# EAGLE design lcd (EAGLE 9.6.2)
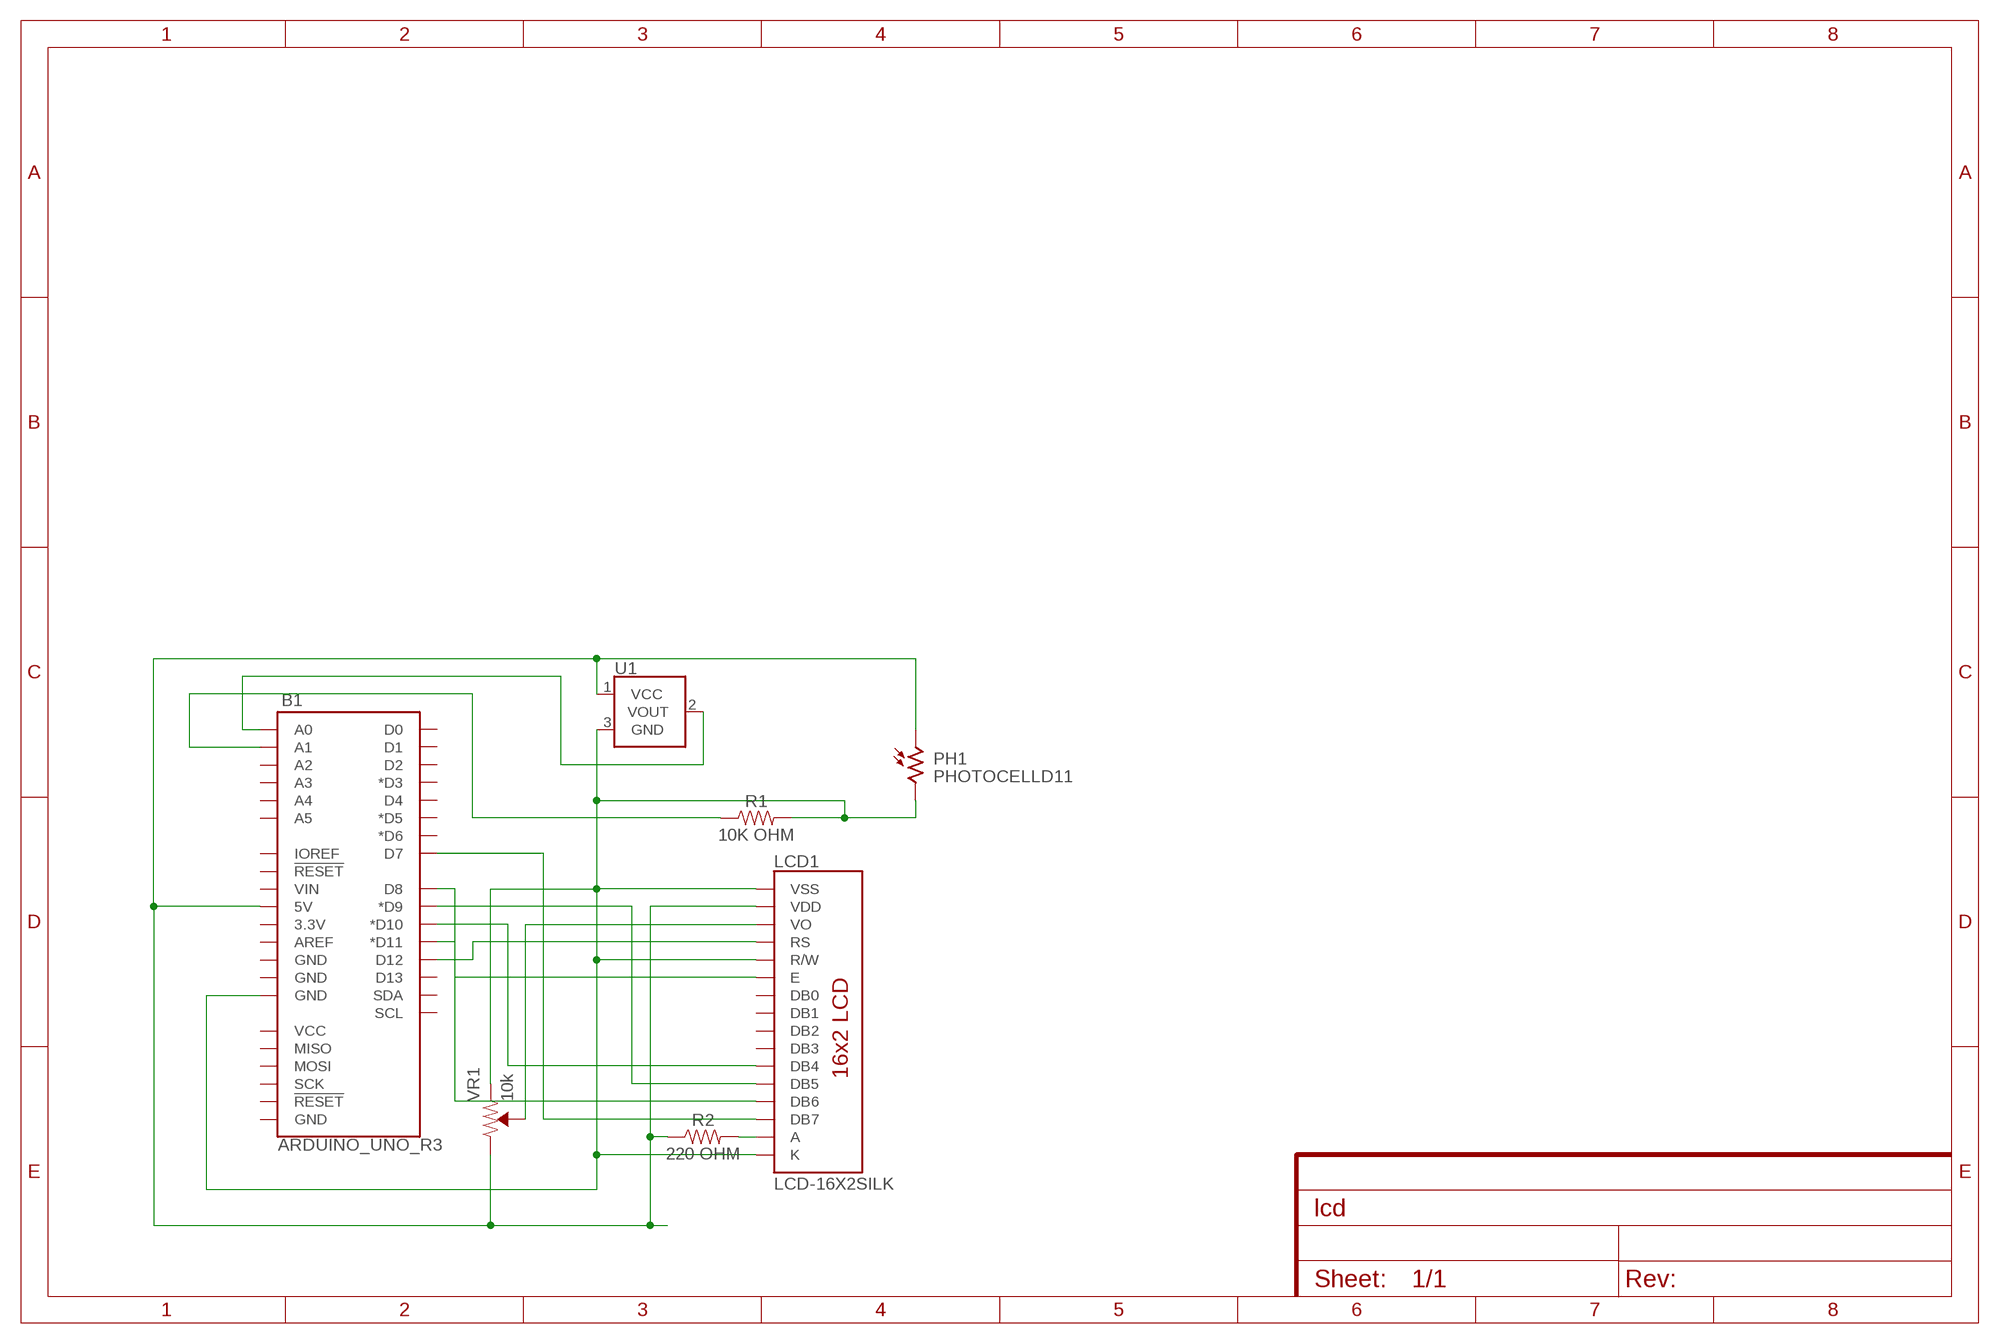
[diagram p0: schematic, sheet 1]

## Parts
B1  ARDUINO_UNO_R3  [ARDUINO_R3]
LCD1  LCD-16X2SILK  [LCD-16X2]
PH1  PHOTOCELLD11  [D11XX_H]
R1  10K OHM  RESISTORAXIAL-0.3  [AXIAL-0.3]
R2  220 OHM  RESISTORAXIAL-0.3  [AXIAL-0.3]
U1  TMP36GT9  [TO-92]
VR1  10k  TRIMPOT-PTH-10MM-KNOB-1/2W-10%  [TRIMPOT-PTH-3386U]

## Nets
N$1: B1.A1 R1.P$1
N$2: B1.A0 U1.2(VOUT)
N$3: B1.5V LCD1.2(VDD) PH1.1 R2.P$1 U1.1(VCC) VR1.3(CW)
N$4: B1.GND@2(GND) LCD1.1(VSS) LCD1.5(R/W) LCD1.16(K) PH1.2 R1.P$2 U1.3(GND) VR1.1(CCW)
N$6: LCD1.3(VO) VR1.2(WIPER)
N$7: LCD1.15(A) R2.P$2
N$8: B1.D7 LCD1.14(DB7)
N$9: B1.D12 LCD1.4(RS)
N$10: B1.D11(*D11) LCD1.6(E)
N$11: B1.D9(*D9) LCD1.12(DB5)
N$12: B1.D8 LCD1.13(DB6)
N$13: B1.D10(*D10) LCD1.11(DB4)
Unconnected: B1.3.3V B1.A2 B1.A3 B1.A4 B1.A5 B1.AREF B1.D0 B1.D1 B1.D2 B1.D3(*D3) B1.D4 B1.D5(*D5) B1.D6(*D6) B1.D13 B1.GND@1(GND) B1.GND@3(GND) B1.GND@4(GND) B1.IOREF B1.MISO B1.MOSI B1.RESET@1(!RESET!) B1.RESET@2(!RESET!) B1.SCK B1.SCL B1.SDA B1.VCC B1.VIN LCD1.7(DB0) LCD1.8(DB1) LCD1.9(DB2) LCD1.10(DB3)

## Library data of the parts
B1 = SparkFun-Boards:ARDUINO_UNO_R3: Arduino R3 Footprint with SPI header Arduino Uno R3 Compatible Footprint. Matches PCB size of the original board. SparkFun Products: SAMD21 Dev Breakout <https://www.sparkfun.com/products/13672> RedBoard <https://www.sparkfun.com/products/12757> R3 Stackable Headers <https://www.sparkfun.com/products/11417>
LCD1 = SparkFun-Displays:LCD-16X2: Standard text-only 16x2 parallel input LCD Basic 16 character by 2 line display. Typically utilizes the extremely common HD44780 parallel interface chipset SparkFun Products: Basic 16x2 Green <https://www.sparkfun.com/products/255> Basic 8x2 Green <https://www.sparkfun.com/products/11122>; PROD_ID: LCD-12633; SF_ID: LCD-00255
PH1 = photo-elements:PHOTOCELL: Photo Sensor
R1 R2 = SparkFun-Resistors:RESISTOR: Generic Resistor Package
U1 = SparkFun-Sensors:TMP36: TMP36 Precision Analog °C Temperature Sensor The TMP36 is a low voltage, precision centigrade temperature sensor. It provides a voltage output that is linearly proportional to the Celsius temperature. It also doesn’t require any external calibration to provide typical accuracies of ±1°C at +25°C and ±2°C over the −40°C to +125°C temperature range. We like it because it’s so easy to use: Just give the device a ground and 2.7 to 5.5 VDC and read the voltage on the Vout pin. The output voltage can be converted to temperature easily using the scale factor of 10 mV/°C. Datasheet <http://cdn.sparkfun.com/datasheets/Sensors/Temp/TMP35_36_37.pdf> SparkFun Products Temperature Sensor - TMP36 <https://www.sparkfun.com/products/10988> (SEN-10988) SparkFun Danger Shield <https://www.sparkfun.com/products/11649> (DEV-11649); PROD_ID: IC-09880; SF_ID: SEN-10988
VR1 = SparkFun-Resistors:TRIMPOT: Trimming Potentiometer (Trimpot) Three-terminal potentiometers, with an adjustable wiper and two adjustable resistors. A pot can be used to create a configurable voltage divider, or as a variable resistor. "Trimpots" are a subset of potentiometers, usually intended for "set-and-forget" applications. They're often more delicate than standard potentiometers - rated for fewer turns. Variants PTH-KNOB - PTH Trimpot w/ finger-adjustable knob Trimpot 10K with Knob <https://www.sparkfun.com/products/9806> (COM-09806) Datasheet <http://www.sparkfun.com/datasheets/Components/General/TSR-3386.pdf> SMD-3MM-CLOSED-FRAME - SMD 3mm Square Closed-Frame Trimpot Used on e.g. EasyDriver - Stepper Motor Driver <https://www.sparkfun.com/products/12779> Datasheet <http://www.bitechnologies.com/pdfs/22.pdf> (22AR10KTR) SMD-5MM - SMD 5mm Square Closed-Frame Trimpot Used on e.g. IOIO-OTG - V2.2 <https://www.sparkfun.com/products/13613> Datasheet <http://www.vishay.com/docs/51008/ts53.pdf> (TS53YL502MR10) SMD-3MM-1/10W-25% - 3mm Square Open-Frame Trimpot Used on e.g. SparkFun Shapeoko <https://www.sparkfun.com/products/13899> Datasheet <http://www.bourns.com/docs/Product-Datasheets/TC33.pdf> (TC33X-2-103E); PROD_ID: RES-09730; SF_SKU: COM-09806

## Board
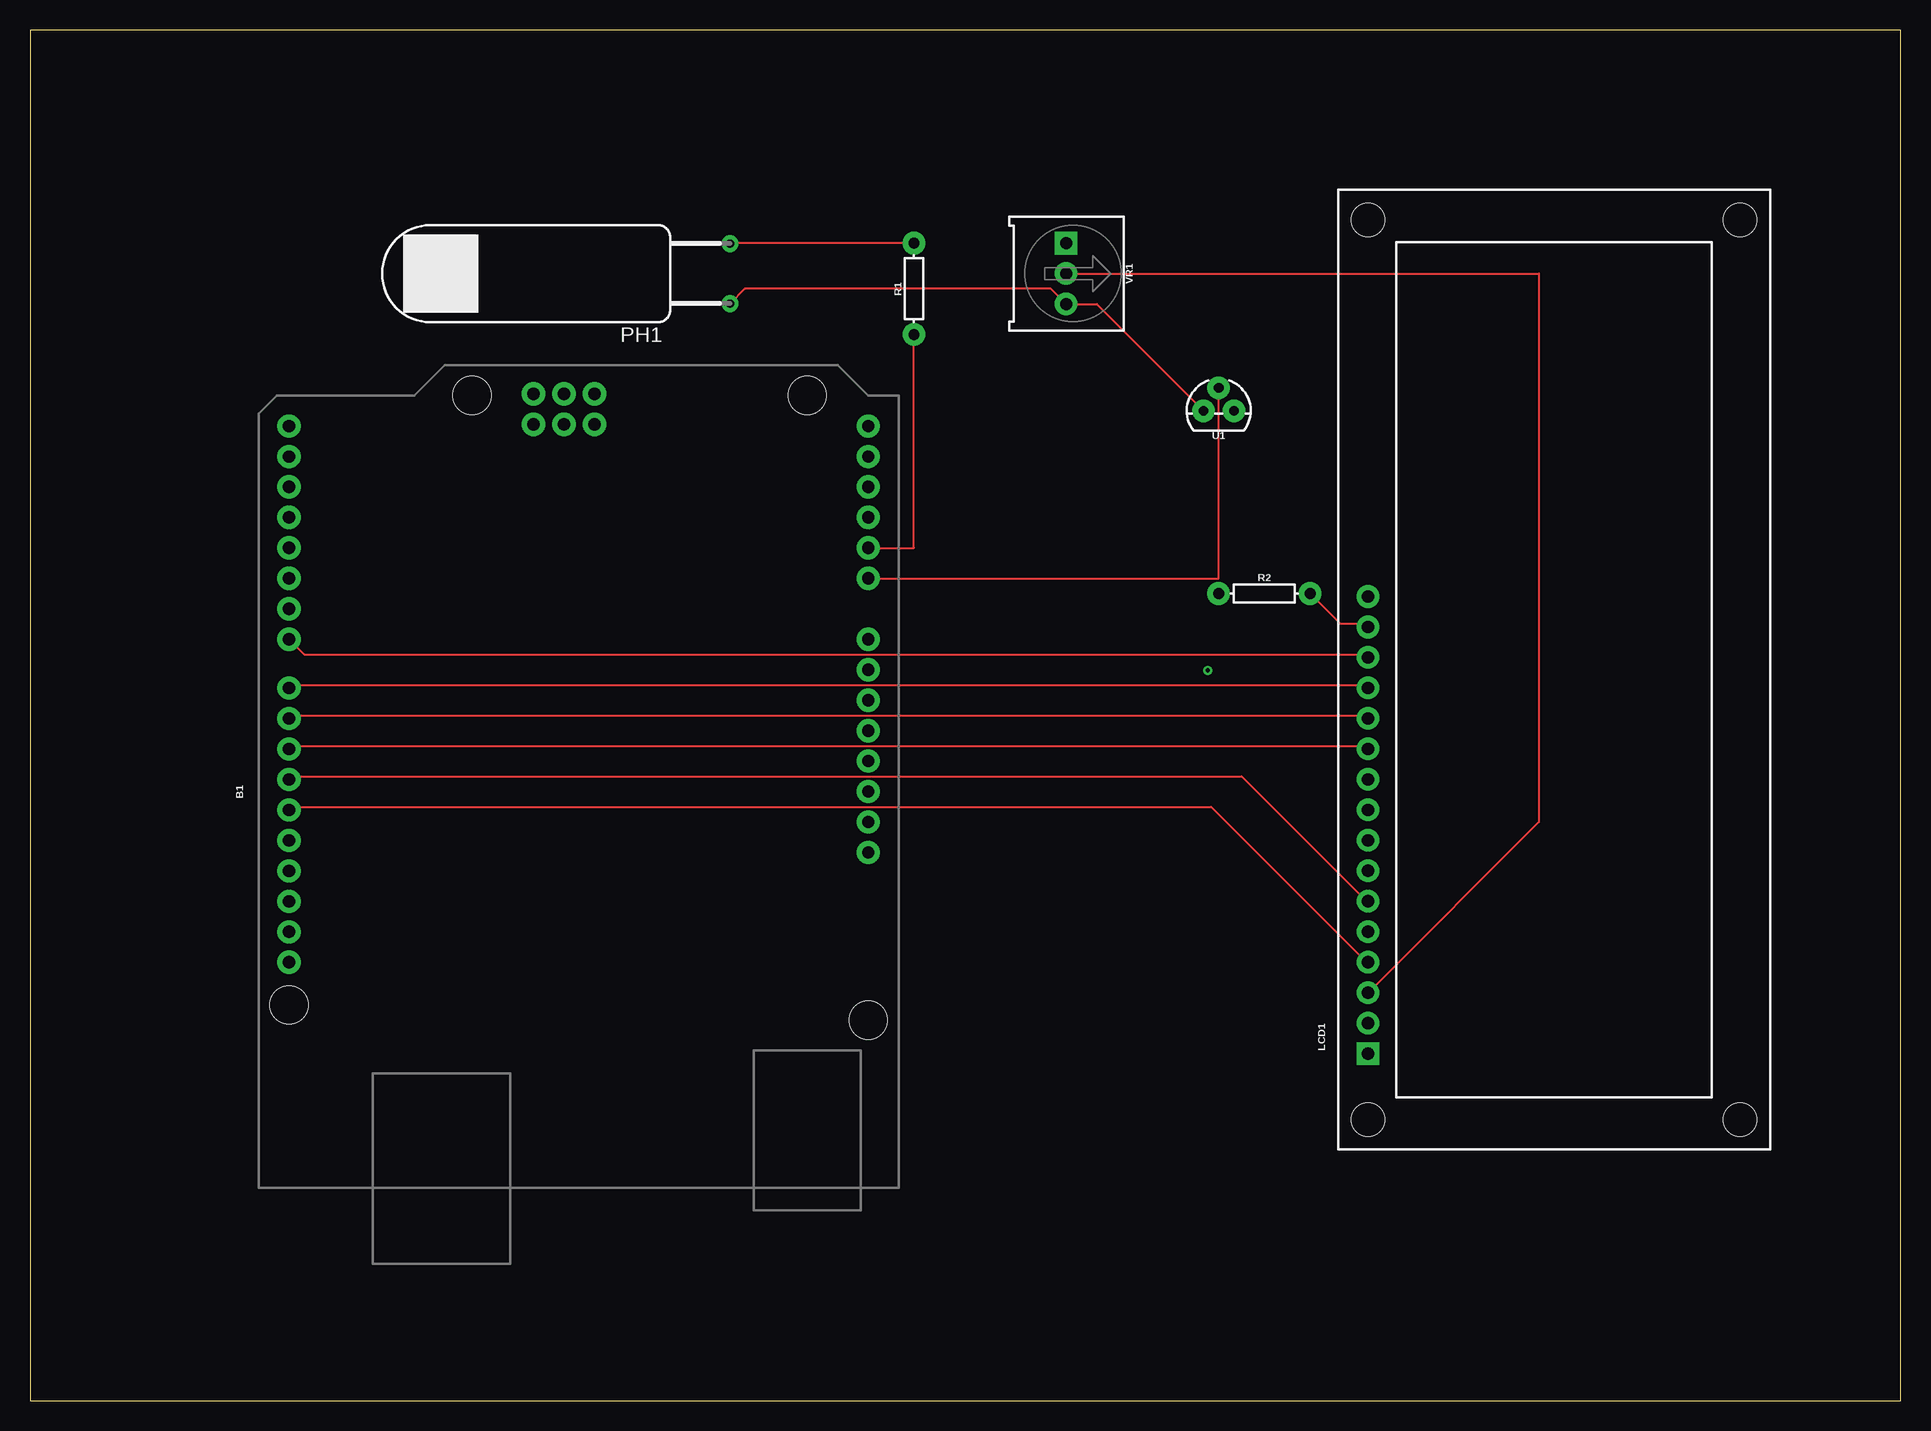
[diagram p1: board, top side]
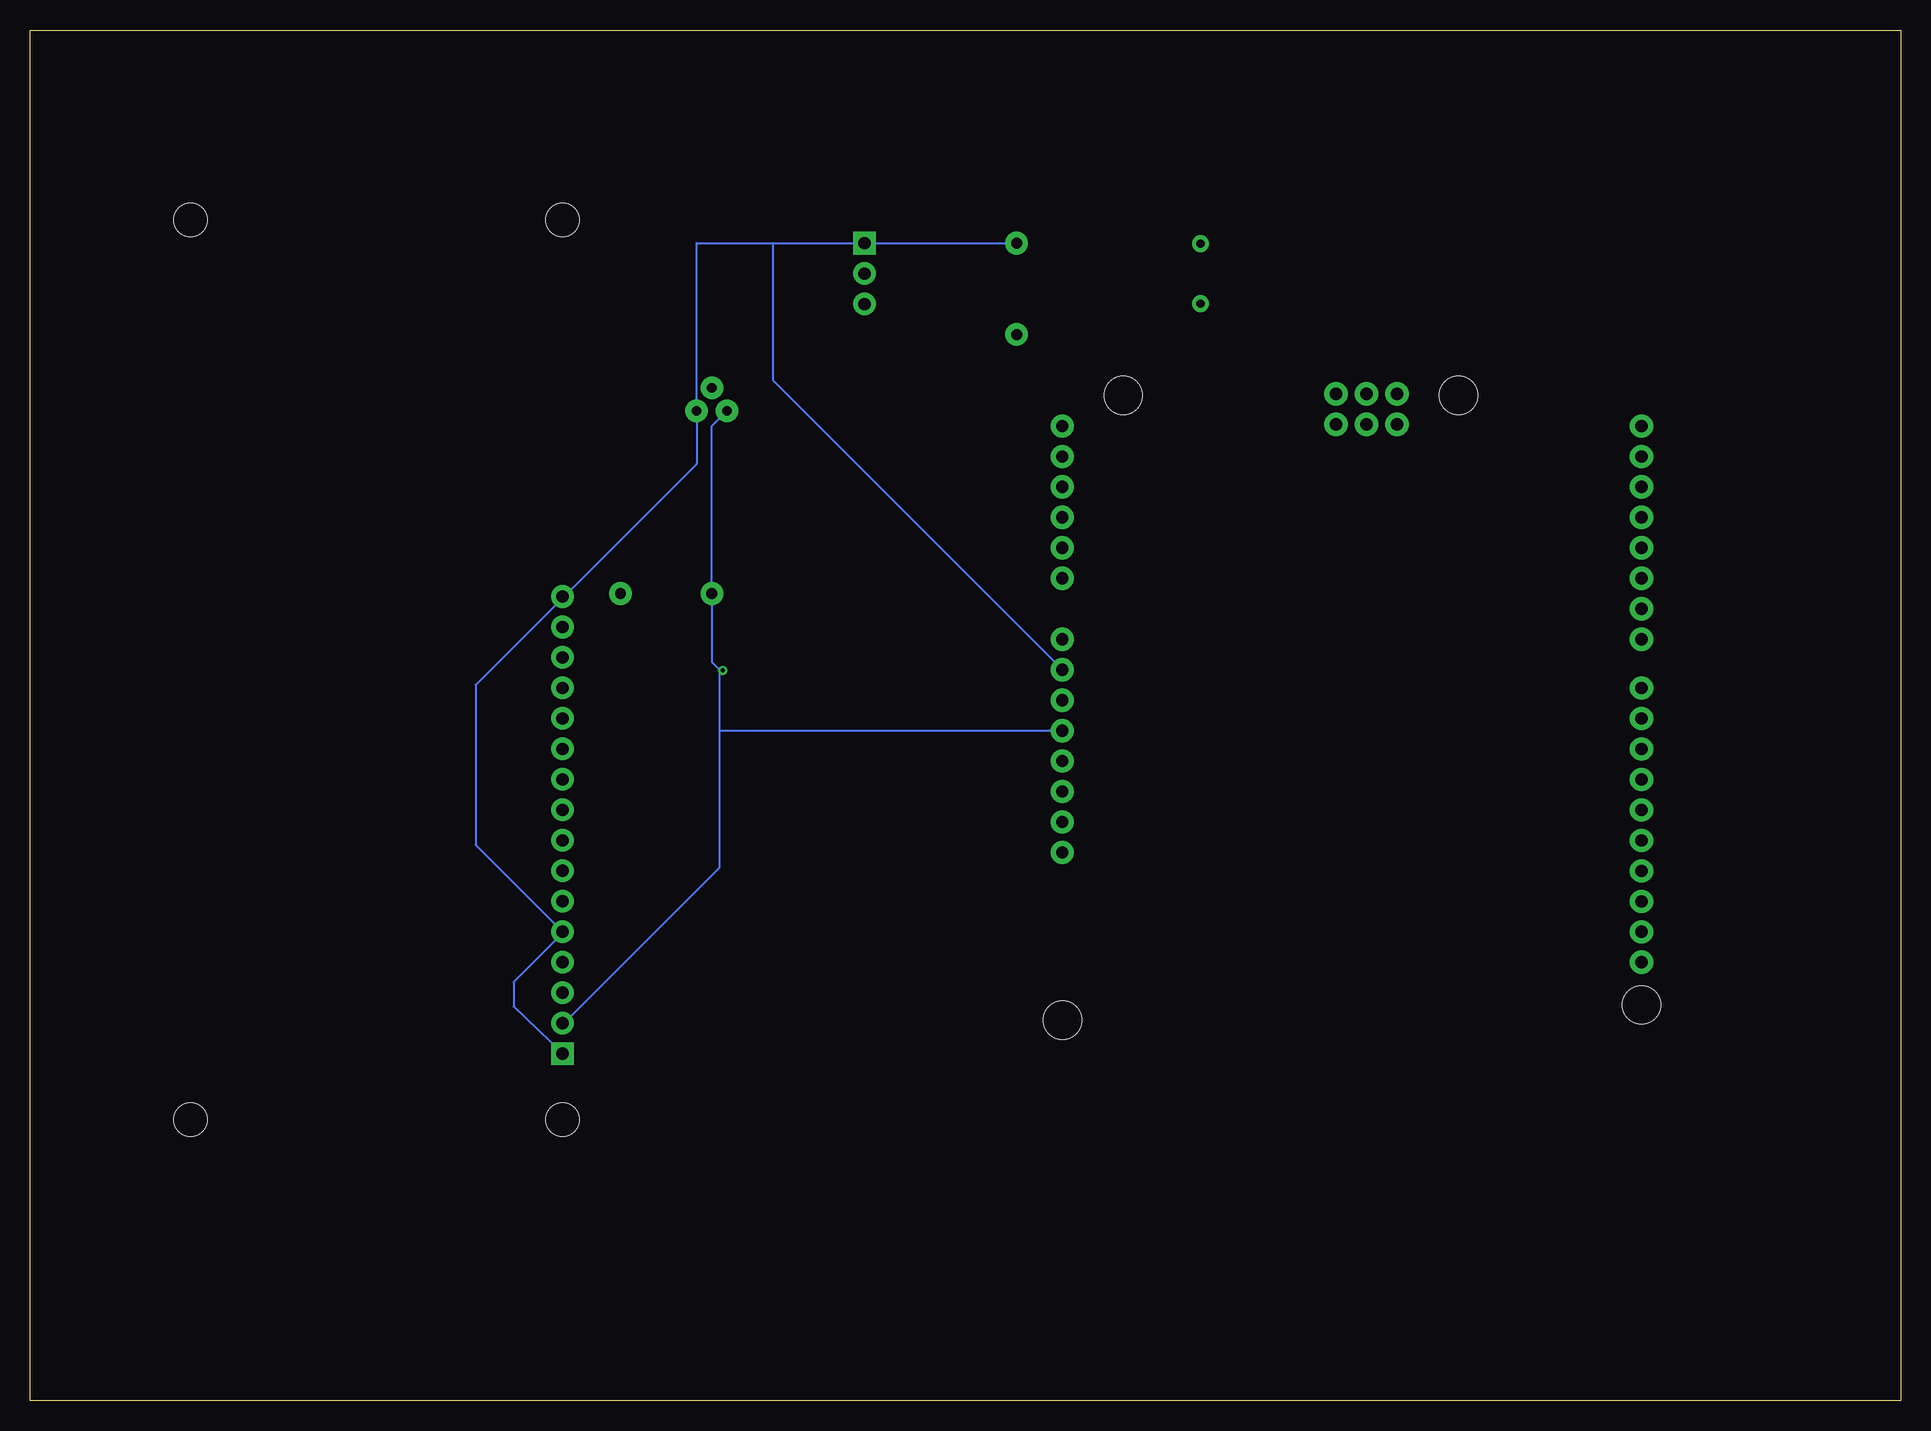
[diagram p2: board, bottom side, seen from below]

Size 155.88 x 114.29 mm. Coordinates in mm from the lower left corner, seen from the top.
Outline: 0,0 155.88,0 155.88,114.29 0,114.29 0,0
Copper layers (1*16): Top 0.035mm / dielectric 1.5mm / Bottom 0.035mm
Design rules "default": minimum track width 6mil, minimum drill 0.35mm, track to track 6mil, track to pad 6mil, pad to pad 6mil, via to via 6mil, smd to smd 6mil, copper to edge 40mil, drill to drill 6mil, minimum pad ring 10mil, minimum via ring 8mil, stop-mask expansion 4mil, vias tented up to drill 0mil, thermal gap 10mil

### Footprints (pad centres in the part's own frame; a part is rotated, then mirrored left to right if it is on the bottom)
ARDUINO_R3 = drill 1.016 pad 1.93: 3.3V 2.54,-24.13; 5V 5.08,-24.13; A0 17.78,-24.13; A1 20.32,-24.13; A2 22.86,-24.13; A3 25.4,-24.13; A4 27.94,-24.13; A5 30.48,-24.13; AREF -9.144,24.13; D0 30.48,24.13; D1 27.94,24.13; D2 25.4,24.13; D3 22.86,24.13; D4 20.32,24.13; D5 17.78,24.13; D6 15.24,24.13; D7 12.7,24.13; D8 8.636,24.13; D9 6.096,24.13; D10 3.556,24.13; D11 1.016,24.13; D12 -1.524,24.13; D13 -4.064,24.13; GND@1 7.62,-24.13; GND@2 10.16,-24.13; GND@3 -6.604,24.13; GND@4 33.16,-1.32; IOREF -2.54,-24.13; MISO 30.62,3.76; MOSI 33.16,1.22; NC -5.08,-24.13; RESET@1 0,-24.13; RESET@2 30.62,-1.32; SCK 30.62,1.22; SCL -14.224,24.13; SDA -11.684,24.13; VCC 33.16,3.76; VIN 12.7,-24.13 | hole 3.175: -17.78,24.13; 33.02,8.89; 33.02,-19.05; -19.05,-24.13
LCD-16X2 = drill 1.016 pad 1.88 square: 1 -32,15.5 | drill 1.016 pad 1.88: 2 -29.46,15.5; 3 -26.92,15.5; 4 -24.38,15.5; 5 -21.84,15.5; 6 -19.3,15.5; 7 -16.76,15.5; 8 -14.22,15.5; 9 -11.68,15.5; 10 -9.14,15.5; 11 -6.6,15.5; 12 -4.06,15.5; 13 -1.52,15.5; 14 1.02,15.5; 15 3.56,15.5; 16 6.1,15.5 | hole 2.8: -37.5,15.5; -37.5,-15.5; 37.5,15.5; 37.5,-15.5
D11XX_H = drill 0.7 pad 1.4: 1 -2.5,-5; 2 2.5,-5
AXIAL-0.3 = drill 0.9 pad 1.88: P$1 -3.81,0; P$2 3.81,0
TO-92 = drill 0.813 pad 1.88: 1 -1.27,0; 2 0,1.905; 3 1.27,0
TRIMPOT-PTH-3386U = drill 1.016 pad 1.88 square: 1 -2.54,-0.015 | drill 1.016 pad 1.88: 2 0,-0.015; 3 2.54,-0.015

### Placement (x,y rotation side)
B1  45.72,50.8 90 top
LCD1  127,60.96 90 top
PH1  53.34,93.98 90 top
R1  73.66,92.71 90 top
R2  102.87,67.31 0 top
U1  99.06,82.55 0 top
VR1  86.36,93.98 270 top

### Tracks (layer width: path | path; a pad name or v marks a point on that pad's centre or on a via)
N$1
  Top 0.152: R1.P$1 73.66,71.12 B1.A1
N$2
  Top 0.152: U1.2 99.06,68.58 B1.A0
N$3  (via drill 0.35)
  Top 0.152: PH1.1 59.57,92.71 85.08,92.71 VR1.3 88.9,91.44 U1.1
  Bottom 0.152: 97.69,82.55 U1.1 99.06,81.28 R2.P$1 99.06,61.59 98.42,60.96 | 97.84,60.91 v98.15,60.91 98.42,60.96 | 98.42,60.96 98.42,55.88 | 98.42,55.88 98.42,44.45 111.12,31.75 LCD1.2 | 98.42,55.88 B1.5V
N$4
  Top 0.152: 73.61,96.57 R1.P$2 58.42,96.52 PH1.2
  Bottom 0.152: LCD1.1 115.57,32.87 115.57,34.92 111.76,38.73 LCD1.5 118.74,46.36 118.74,59.69 111.12,67.31 | 111.12,67.31 100.33,78.1 U1.3 100.33,96.52 93.98,96.52 | 111.12,67.31 LCD1.16 | 93.98,96.52 VR1.1 R1.P$2 | B1.GND@2 93.98,85.09 93.98,96.52
N$6
  Top 0.152: VR1.2 125.73,93.98 125.73,48.26 111.76,34.29 LCD1.3
  Bottom 0.152: 85.8,93.98 VR1.2
N$7
  Top 0.152: R2.P$2 109.22,64.77 111.12,64.77 LCD1.15
N$8
  Top 0.152: B1.D7 22.86,62.23 111.12,62.23 LCD1.14
N$9
  Top 0.152: LCD1.4 111.12,36.83 98.42,49.53 21.59,49.53 B1.D12
N$10
  Top 0.152: LCD1.6 111.12,41.91 100.97,52.07 21.59,52.07 B1.D11
N$11
  Top 0.152: LCD1.12 111.12,57.15 21.59,57.15 B1.D9
N$12
  Top 0.152: LCD1.13 111.12,59.69 21.59,59.69 B1.D8
N$13
  Top 0.152: LCD1.11 111.12,54.61 21.59,54.61 B1.D10